# Altium schematic sheet universal_DC-DC.SchDoc
size A4
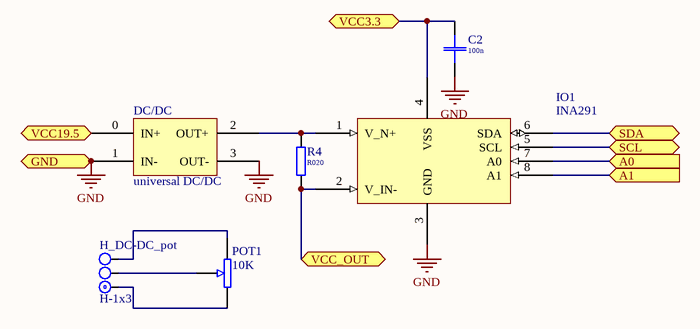
[diagram p0: universal_DC-DC.SchDoc]

## Parts
C2  100n  [C0805(2013)]
DC/DC  universal DC/DC  [MP1584EN dc/dc 3A vertical]
H_DC-DC_pot  H-1x3  [J1x3]
IO1  INA291  [SOT23-8L]
POT1  10K  [3590  potenciometer]
R4  R020  [R2512]

## Ports
A0 (in), A1 (in), GND, SCL, SDA, VCC3.3, VCC19.5, VCC_OUT

## Nets
GND: C2.2 DC/DC.1(IN-) DC/DC.3(OUT-) IO1.3(GND) ; port GND
A0: IO1.7(A0) ; port A0
A1: IO1.8(A1) ; port A1
SCL: IO1.5(SCL) ; port SCL
SDA: IO1.6(SDA) ; port SDA
VCC3.3: C2.1 IO1.4(VSS) ; port VCC3.3
VCC19.5: DC/DC.0(IN+) ; port VCC19.5
VCC_OUT: IO1.2(V_IN-) R4.2 ; port VCC_OUT
NetDC/DC_2: DC/DC.2(OUT+) IO1.1(V_N+) R4.1
NetH_DC-DC_pot_1: H_DC-DC_pot.1 POT1.3
NetH_DC-DC_pot_2: H_DC-DC_pot.2 POT1.2
NetH_DC-DC_pot_3: H_DC-DC_pot.3 POT1.1

## Library data of the parts
C2 = C-0805  100V 10n: SMD-0805 100V X7R 10%; Price: 0.062; Value: 100n
IO1 = INA291: Zerø-Drift, Bi-Directional  CURRENT/POWER MONITOR with I2C™ Interface
POT1 = Potenciometer: Value: 10K
R4 = R-0805: SMD 0805 0.1W 5% 150V; Price: 0.017; Value: R020
H_DC-DC_pot = H-1x3: Price: 0.03